# Altium schematic sheet Sheet4_misc.SchDoc: Misc
size A4; DrawnBy: D.N.Nhuan; Revision: NT-1.1; SheetNumber: 4; SheetTotal: 5
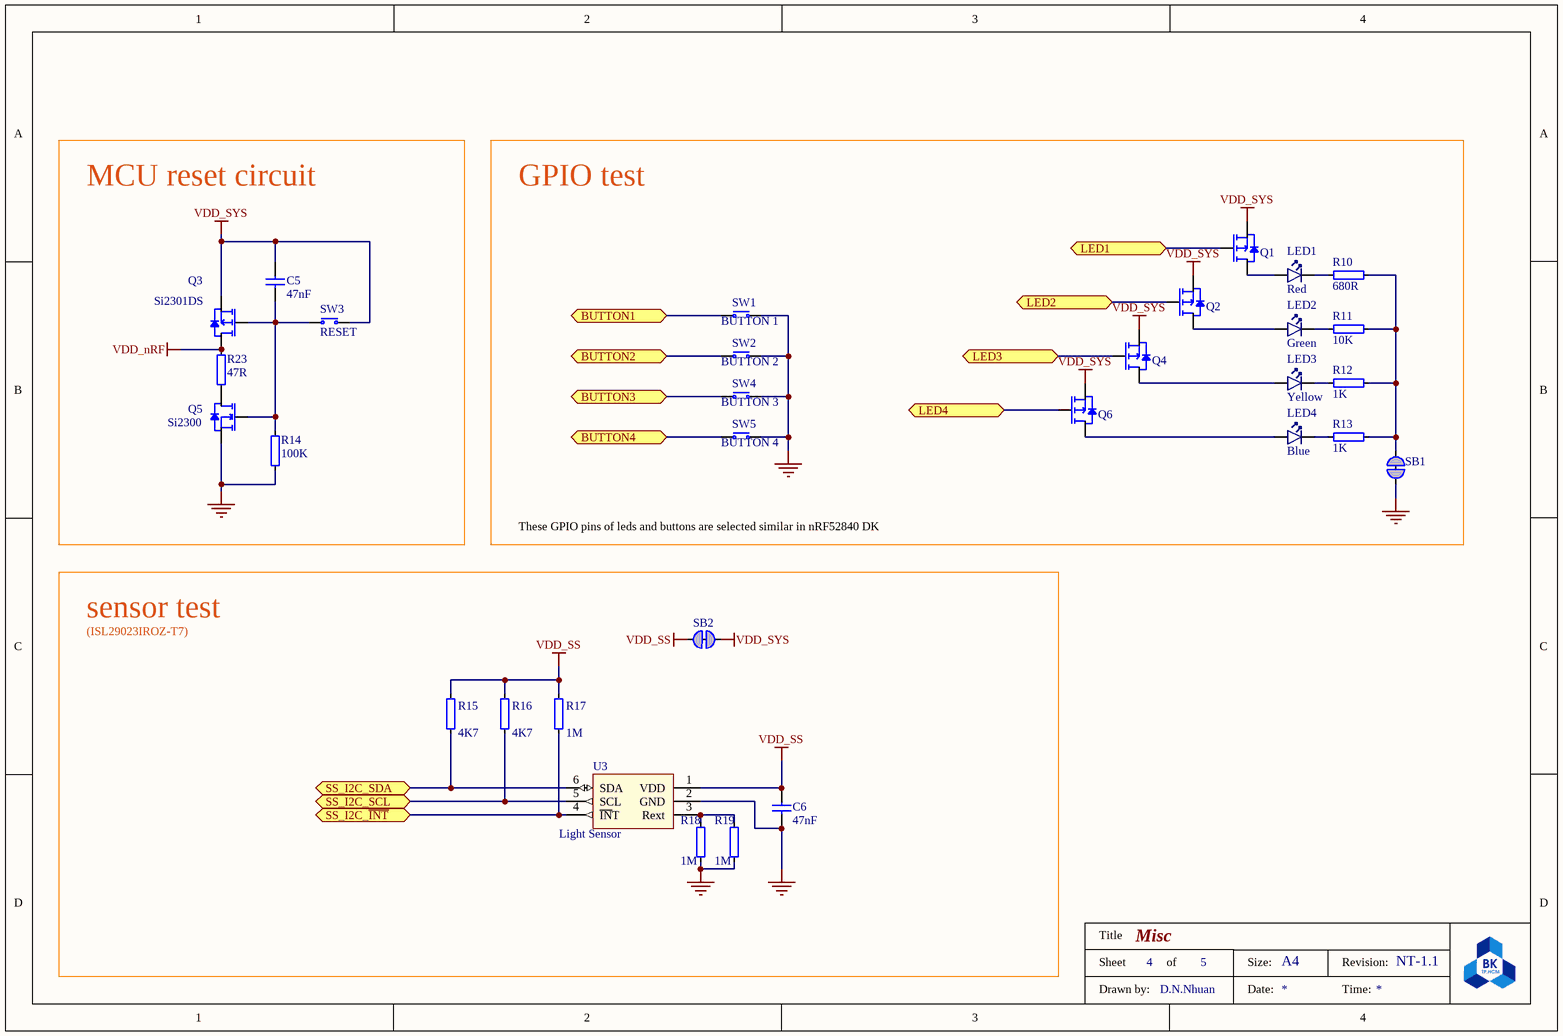
[diagram p0: Sheet4_misc.SchDoc]

## Parts
C5  47nF  [0402 imperial]
C6  47nF  [0402 imperial]
LED1  Red  [LED_0603]
LED2  Green  [LED_0603]
LED3  Yellow  [LED_0603]
LED4  Blue  [LED_0603]
Q1  Si2301DS  [SOT-23]  (value not drawn)
Q2  Si2301DS  [SOT-23]  (value not drawn)
Q3  Si2301DS  [SOT-23]
Q4  Si2301DS  [SOT-23]  (value not drawn)
Q5  Si2300  [SOT-23]
Q6  Si2301DS  [SOT-23]  (value not drawn)
R10  680R  [0805_Imperial]
R11  10K  [0805_Imperial]
R12  1K  [0805_Imperial]
R13  1K  [0805_Imperial]
R14  100K  [0402 imperial]
R15  4K7  [0402 imperial]
R16  4K7  [0402 imperial]
R17  1M  [0402 imperial]
R18  1M  [0402 imperial]
R19  1M  [0402 imperial]
R23  47R  [0805_Imperial]
SB1  Solderbridge  [Solderbridge_Shorted]  (value not drawn)  (net tie, no BOM)
SB2  Solderbridge  [Solderbridge_Shorted]  (value not drawn)  (net tie, no BOM)
SW1  BUTTON 1  [Switch-PB-4.5x4.5mm-SMD]
SW2  BUTTON 2  [Switch-PB-4.5x4.5mm-SMD]
SW3  RESET  [Switch-PB-4.5x4.5mm-SMD]
SW4  BUTTON 3  [Switch-PB-4.5x4.5mm-SMD]
SW5  BUTTON 4  [Switch-PB-4.5x4.5mm-SMD]
U3  Light Sensor  [SON65P200X210X80-7N]

## Blocks framed on the sheet
MCU reset circuit: C5 Q3 Q5 R14 R23 SW3
GPIO test: LED1-LED4 Q1 Q2 Q4 Q6 R10-R13 SB1 SW1 SW2 SW4 SW5
sensor test: C6 R15-R19 SB2 U3

## Ports
BUTTON1 (bidir), BUTTON2 (bidir), BUTTON3 (bidir), BUTTON4 (bidir), LED1 (bidir), LED2 (bidir), LED3 (bidir), LED4 (bidir), SS_I2C_SCL, SS_I2C_SDA, SS_I2C_~{INT}

## Nets
GND: C6.1 Q5.2(S) R14.1 R18.1 R19.1 SB1.2 SW1.1(N.O) SW2.1(N.O) SW4.1(N.O) SW5.1(N.O) U3.2(GND) U3.7(GND)
VDD_nRF: Q3.3(D) R23.2
VDD_SS: C6.2 R15.2 R16.2 R17.2 SB2.2 U3.1(VDD)
VDD_SYS: C5.2 Q1.2(S) Q2.2(S) Q3.2(S) Q4.2(S) Q6.2(S) SB2.1 SW3.1(N.O)
BUTTON1: SW1.2(COM) ; port BUTTON1
BUTTON2: SW2.2(COM) ; port BUTTON2
BUTTON3: SW4.2(COM) ; port BUTTON3
BUTTON4: SW5.2(COM) ; port BUTTON4
LED1: Q1.1(G) ; port LED1
LED2: Q2.1(G) ; port LED2
LED3: Q4.1(G) ; port LED3
LED4: Q6.1(G) ; port LED4
SS_I2C_~{INT}: R17.1 U3.4(~{IN}T) ; port SS_I2C_~{INT}
SS_I2C_SCL: R16.1 U3.5(SCL) ; port SS_I2C_SCL
SS_I2C_SDA: R15.1 U3.6(SDA) ; port SS_I2C_SDA
NetC5_1: C5.1 Q3.1(G) Q5.1(G) R14.2 SW3.2(COM)
NetLED1_1: LED1.1(C) R10.1
NetLED1_2: LED1.2(A) Q1.3(D)
NetLED2_1: LED2.1(C) R11.1
NetLED2_2: LED2.2(A) Q2.3(D)
NetLED3_1: LED3.1(C) R12.1
NetLED3_2: LED3.2(A) Q4.3(D)
NetLED4_1: LED4.1(C) R13.1
NetLED4_2: LED4.2(A) Q6.3(D)
NetQ5_3: Q5.3(D) R23.1
NetR10_2: R10.2 R11.2 R12.2 R13.2 SB1.1
NetR18_2: R18.2 R19.2 U3.3(Rext)

## Notes on the sheet
- These GPIO pins of leds and buttons are selected similar in nRF52840 DK
- (ISL29023IROZ-T7)
- Title
- Sheet
- of
- Size:
- A4
- Revision:
- Drawn by:
- Date:
- Time:

## Library data of the parts
C5 C6 = Capacitor: Genaral Schematic; Tolerance: ±5%; Value: 47nF; Suppiler: *; Link of Supplier: *; Manufacturer: *; Manufacturer Part Number: *; Footprint: 0402
LED1-LED4 = LED: General Schematic; Footprint: 0603
  LED1: Color: Red
  LED2: Color: Green
  LED3: Color: Yellow
  LED4: Color: Blue
Q1-Q4 Q6 = MOS-P: SOT-23 1-G 2-S 3-D
Q5 = MOS-N: SOT-23 1-G 2-S 3-D
R10-R17 R23 = Resistor: General Schematic; Tolerance: ±5%; Supplier: *; Link of Supplier: *; Footprint: 0402
  R10: Value: 680R
  R11: Value: 10K
  R12 R13: Value: 1K
  R14: Value: 100K
  R15 R16: Value: 4K7
  R17: Value: 1M
  R23: Value: 47R
R18 R19 = Resistor: General Schematic; Tolerance: ±1%; Value: 1M; Supplier: thegioiic; Link of Supplier: http://thegioiic.com/products/dien-tro-510k-ohm-0402-1; Footprint: 0402
SB1 SB2 = Solderbridge Shorted: Shorted Solderbridge; Artikkelnr Noca: N.A.; Part Number: Solderbridge Shorted; Manufacturer: *; Manufacturer Part Number: *; Datasheet: *; LatestRevisionDate: 2012-08-07; Pin Count: 2; Publisher: Nordic Semiconductor; Published: 2012-08-07; Value: Solderbridge; Note: *; Supplier: *; Supplier part number: *; 2nd source Supplier: *; 2nd source part number: *; Footprint Doc: Solderbridge_Shorted; Artikkelnr Simpro: N.A.
SW1-SW5 = Switch-PB: Push Button; Manufacturer: *; Manufacturer Part Number: *; Pin Count: 4; Note: *; Part Number: *
  SW1: Value: BUTTON 1
  SW2: Value: BUTTON 2
  SW3: Value: RESET
  SW4: Value: BUTTON 3
  SW5: Value: BUTTON 4
U3 = ISL29023IROZ-T7: Light Sensor, 2.1x2mm; Manufacturer: Intersil; Footprint: DFN 6; Manufacturer Partnumber: ISL29023IROZ-T7; Type Sensor: Light Sensor